# EAGLE design RFID_H2_v7 (EAGLE 9.6.2)
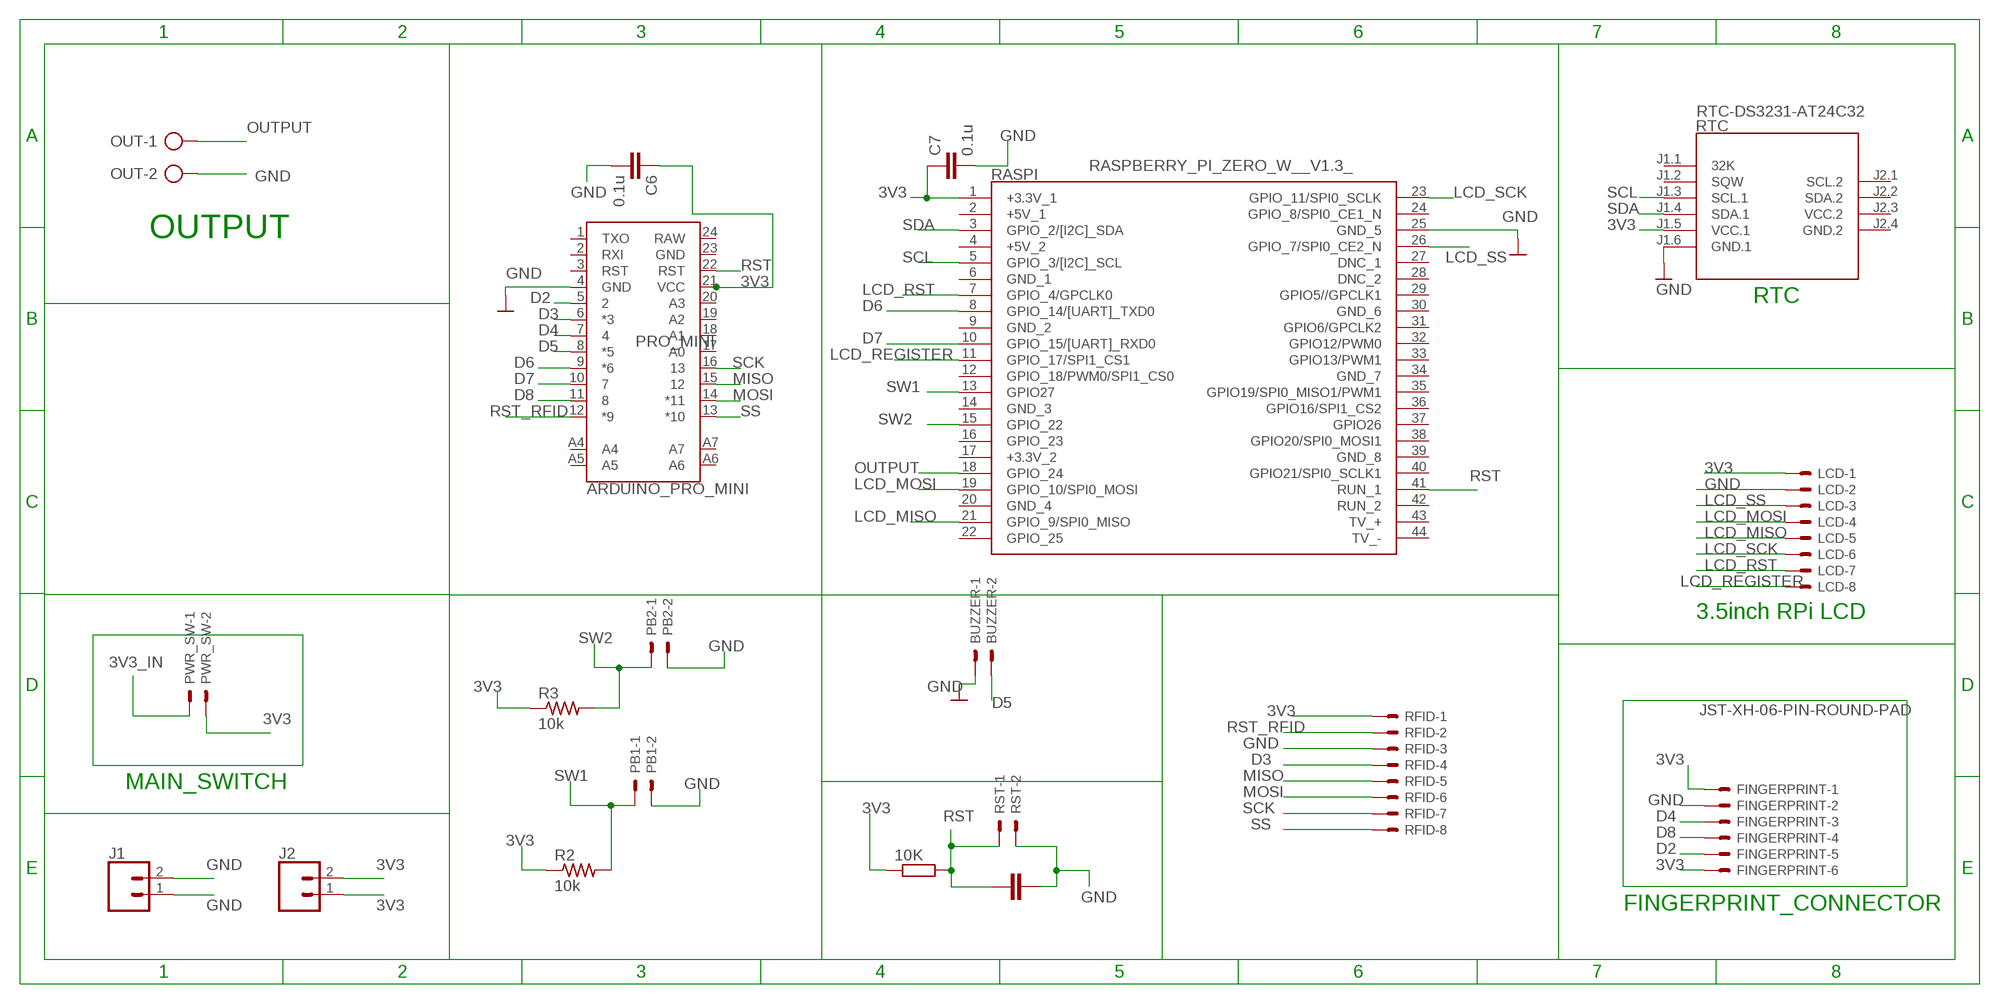
[diagram p0: schematic, sheet 1, part 1 of 2]
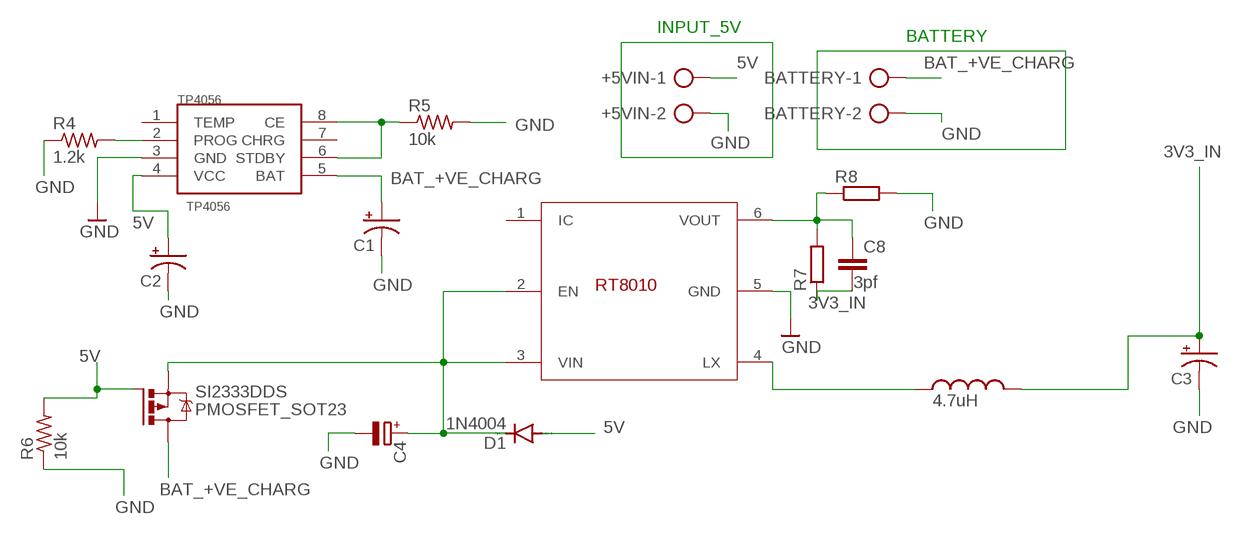
[diagram p1: schematic, sheet 1, part 2 of 2]

## Parts
10K  R-EU_0204/5  [0204/5]
+5VIN  AK500/2-H  [AK500/2-H]
BATTERY  AK500/2-H  [AK500/2-H]
BUZZER  JST-XH-02-PIN-LONG-PAD  [JST-XH-02-PACKAGE-LONG-PAD]
C1  10uf  CAP_POL_10V  [C/6032-28R]
C2  10uf  CAP_POL_10V  [C/6032-28R]
C3  10uf  CAP_POL_10V  [C/6032-28R]
C4  4.7uf  CPOL-EUE2.5-6  [E2,5-6]
C5  10n  C-EUC0805K  [C0805K]
C6  0.1u  C-EUC0805  [C0805]
C7  0.1u  C-EUC0805  [C0805]
C8  3pf  C-EU025-025X050  [C025-025X050]
D1  1N4004  [DO41-10]
FINGERPRINT  JST-XH-06-PIN-ROUND-PAD  [JST-XH-06-PACKAGE-ROUND-PAD]
J1  CONN_02  [1X02]
J2  CONN_02  [1X02]
L2  4.7uH  WE-TI_8095_744772047  [WE-TI_TIHV_8095]
LCD  JST-XH-08-PIN-ROUND-PAD  [JST-XH-08-PACKAGE-ROUND-PAD]
OUT  AK500/2-H  [AK500/2-H]
PB1  JST-XH-02-PIN-LONG-PAD  [JST-XH-02-PACKAGE-LONG-PAD]
PB2  JST-XH-02-PIN-LONG-PAD  [JST-XH-02-PACKAGE-LONG-PAD]
PRO_MINI  ARDUINO_PRO_MINI  [ARDUINO_PRO_MINI]
PWR_SW  JST-XH-02-PIN-LONG-PAD  [JST-XH-02-PACKAGE-LONG-PAD]
R2  10k  R-US_R0805  [R0805]
R3  10k  R-US_R0805  [R0805]
R4  1.2k  R-US_R0805  [R0805]
R5  10k  R-US_R0805  [R0805]
R6  10k  R-US_R0805  [R0805]
R7  1.2M  R-EU_0204/7  [0204/7]
R8  270K  R-EU_0204/7  [0204/7]
RASPI  RASPBERRY_PI_ZERO_W__V1.3_  [RASPBERRYPIZEROWV13]
RFID  JST-XH-08-PIN-ROUND-PAD  [JST-XH-08-PACKAGE-ROUND-PAD]
RST  JST-XH-02-PIN-LONG-PAD  [JST-XH-02-PACKAGE-LONG-PAD]
RT8010  RT8010_BUCK_CONVERTER  [RT8010]
RTC  RTC-DS3231-AT24C32  [RTC-DS3231-AT24C32]
SI2333DDS  PMOSFET_SOT23  [SOT23]
TP4056  TP4056  [SOP-8]

## Nets
3V3: 10K.1 C6.1 C7.1 FINGERPRINT.1 FINGERPRINT.6 J2.1 J2.2 LCD.1 PRO_MINI.21(VCC) PWR_SW.2 R2.1 R3.1 RASPI.1(+3.3V_1) RFID.1 RTC.J1.5(VCC.1)
3V3_IN: C3.+ C8.2 L2.2 PWR_SW.1 R7.1
5V: +5VIN.1 C2.+ D1.A R6.2 SI2333DDS.1(G) TP4056.4(VCC)
BAT_+VE_CHARG: BATTERY.1 C1.+ SI2333DDS.3(D) TP4056.5(BAT)
D2: FINGERPRINT.5 PRO_MINI.5
D3: PRO_MINI.6(*3) RFID.4
D4: FINGERPRINT.3 PRO_MINI.7
D5: BUZZER.2 PRO_MINI.8(*5)
D6: PRO_MINI.9(*6) RASPI.8(GPIO_14/[UART]_TXD0)
D7: PRO_MINI.10 RASPI.10(GPIO_15/[UART]_RXD0)
D8: FINGERPRINT.4 PRO_MINI.11
GND: +5VIN.2 BATTERY.2 BUZZER.1 C1.- C2.- C3.- C4.- C5.1 C6.2 C7.2 FINGERPRINT.2 J1.1 J1.2 LCD.2 OUT.2 PB1.2 PB2.2 PRO_MINI.4(GND) R4.1 R5.2 R6.1 R8.2 RASPI.25(GND_5) RFID.3 RST.2 RT8010.5(GND) RTC.J1.6(GND.1) TP4056.3(GND)
LCD_MISO: LCD.5 RASPI.21(GPIO_9/SPI0_MISO)
LCD_MOSI: LCD.4 RASPI.19(GPIO_10/SPI0_MOSI)
LCD_REGISTER: LCD.8 RASPI.11(GPIO_17/SPI1_CS1)
LCD_RST: LCD.7 RASPI.7(GPIO_4/GPCLK0)
LCD_SCK: LCD.6 RASPI.23(GPIO_11/SPI0_SCLK)
LCD_SS: LCD.3 RASPI.26(GPIO_7/SPI0_CE2_N)
MISO: PRO_MINI.15 RFID.5
MOSI: PRO_MINI.14(*11) RFID.6
N$2: C8.1 R7.2 R8.1 RT8010.6(VOUT)
N$4: R4.2 TP4056.2(PROG)
N$5: R5.1 TP4056.6(STDBY) TP4056.8(CE)
N$6: L2.1 RT8010.4(LX)
N$8: C4.+ D1.C RT8010.2(EN) RT8010.3(VIN) SI2333DDS.2(S)
OUTPUT: OUT.1 RASPI.18(GPIO_24)
RST: 10K.2 C5.2 PRO_MINI.22(RST) RASPI.41(RUN_1) RST.1
RST_RFID: PRO_MINI.12(*9) RFID.2
SCK: PRO_MINI.16 RFID.7
SCL: RASPI.5(GPIO_3/[I2C]_SCL) RTC.J1.3(SCL.1)
SDA: RASPI.3(GPIO_2/[I2C]_SDA) RTC.J1.4(SDA.1)
SS: PRO_MINI.13(*10) RFID.8
SW1: PB1.1 R2.2 RASPI.13(GPIO27)
SW2: PB2.1 R3.2 RASPI.15(GPIO_22)
Unconnected: PRO_MINI.1(TXO) PRO_MINI.2(RXI) PRO_MINI.3(RST) PRO_MINI.17(A0) PRO_MINI.18(A1) PRO_MINI.19(A2) PRO_MINI.20(A3) PRO_MINI.A4 PRO_MINI.A5 PRO_MINI.A6 PRO_MINI.A7 RASPI.2(+5V_1) RASPI.4(+5V_2) RASPI.6(GND_1) RASPI.9(GND_2) RASPI.12(GPIO_18/PWM0/SPI1_CS0) RASPI.14(GND_3) RASPI.16(GPIO_23) RASPI.17(+3.3V_2) RASPI.20(GND_4) RASPI.22(GPIO_25) RASPI.24(GPIO_8/SPI0_CE1_N) RASPI.27(DNC_1) RASPI.28(DNC_2) RASPI.29(GPIO5//GPCLK1) RASPI.30(GND_6) RASPI.31(GPIO6/GPCLK2) RASPI.32(GPIO12/PWM0) RASPI.33(GPIO13/PWM1) RASPI.34(GND_7) RASPI.35(GPIO19/SPI0_MISO1/PWM1) RASPI.36(GPIO16/SPI1_CS2) RASPI.37(GPIO26) RASPI.38(GPIO20/SPI0_MOSI1) RASPI.39(GND_8) RASPI.40(GPIO21/SPI0_SCLK1) RASPI.42(RUN_2) RASPI.43(TV_+) RASPI.44(TV_-) RT8010.1(IC) RTC.J1.1(32K) RTC.J1.2(SQW) RTC.J2.1(SCL.2) RTC.J2.2(SDA.2) TP4056.1(TEMP) TP4056.7(CHRG)

## Notes on the sheet
- INPUT_5V
- BATTERY
- OUTPUT
- RTC
- 3.5inch RPi LCD
- MAIN_SWITCH
- FINGERPRINT_CONNECTOR

## Power pins joined to a net without a drawn wire
GND: PRO_MINI.23(GND)
GND.2: RTC.J2.4(GND.2)
RAW: PRO_MINI.24(RAW)
VCC.2: RTC.J2.3(VCC.2)

## Library data of the parts
10K = resistor:R-EU_: RESISTOR, European symbol
+5VIN BATTERY OUT = con-ptr500:AK500/2-H: CONNECTOR Aug. 2004 / PTR Meßtechnik: Die Bezeichnung der Serie AK505 wurde geändert. Es handelt sich hierbei um AK500 in horizontaler Ausführung.; OC_FARNELL: unknown; OC_NEWARK: unknown
BUZZER PB1 PB2 PWR_SW RST = Rembrandt Electronics - JST XH Connectors v1-0:JST-XH-02-PIN: JST XH Connector 2 Pin Wire to board connector. Pitch: 2,54 mm, (0.100") Number of pins: 2 Created by Rembrandt Electronics www.rembrandtelectronics.com
C1-C3 = CEDT_JANUARY_2015_v5:CAP_POL
C4 = rcl:CPOL-EU: POLARIZED CAPACITOR, European symbol; SPICEPREFIX: C
C5-C8 = rcl:C-EU: CAPACITOR, European symbol; SPICEPREFIX: C
D1 = diode:1N4004: DIODE general purpose rectifier, 1 A
FINGERPRINT = Rembrandt Electronics - JST XH Connectors v1-0:JST-XH-06-PIN: JST XH Connector 2 Pin Wire to board connector. Pitch: 2,54 mm, (0.100") Number of pins: 6 Created by Rembrandt Electronics www.rembrandtelectronics.com
J1 J2 = SparkFun-Connectors:CONN_02: Multi connection point. Often used as Generic Header-pin footprint for 0.1 inch spaced/style header connections On any of the 0.1 inch spaced packages, you can populate with these: Break Away Headers - Straight <https://www.sparkfun.com/products/116> (PRT-00116) Break Away Male Headers - Right Angle <https://www.sparkfun.com/products/553> (PRT-00553) Female Headers <https://www.sparkfun.com/products/115> (PRT-00115) Break Away Headers - Machine Pin <https://www.sparkfun.com/products/117> (PRT-00117) Break Away Female Headers - Swiss Machine Pin <https://www.sparkfun.com/products/743> (PRT-00743) For SCREWTERMINALS and SPRING TERMINALS visit here: Screw Terimnals on SparkFun.com <https://www.sparkfun.com/search/results?term=Screw+Terminals> (5mm/3.5mm/2.54mm spacing) This device is also useful as a general connection point to wire up your design to another part of your project. Our various solder wires solder well into these plated through hole pads. Hook-Up Wire - Assortment (Stranded, 22 AWG) <https://www.sparkfun.com/products/11375> (PRT-11375) Hook-Up Wire - Assortment (Solid Core, 22 AWG) <https://www.sparkfun.com/products/11367> (PRT-11367) View the entire wire category on our website here <https://www.sparkfun.com/categories/141> Special notes: Molex polarized connector foot print use with: PRT-08233 with associated crimp pins and housings. 2.54_SCREWTERM for use with PRT-10571. 3.5mm Screw Terminal footprints for PRT-08084 5mm Screw Terminal footprints for use with PRT-08432
L2 = Wurth_Elektronik_Passive_rev19e:WE-TI_8095: Radial Leaded Wire Wound Inductor Characteristics Radial through-hole inductor High saturation core material Small size Maximum current up to 8.5 A Custom design on request Applications Signal filtering Switches, switching power supply for small and medium voltage Power supply filter EMI filter <http://katalog.we-online.de/media/images/v2/we-ti_tonneninduktivitaet.jpg> Details see: http://katalog.we-online.de/en/pbs/WE-TI? Updated by Dan Xu 2014-07-11 2014 (C) Wurth Elektronik; WE-NUMBER: 744772047/4,7uH
LCD RFID = Rembrandt Electronics - JST XH Connectors v1-0:JST-XH-08-PIN: JST XH Connector 2 Pin Wire to board connector. Pitch: 2,54 mm, (0.100") Number of pins: 8 Created by Rembrandt Electronics www.rembrandtelectronics.com
PRO_MINI = SparkFun-Boards:ARDUINO_PRO_MINI: SparkFun Pro Mini Pro Mini compatible footprint. Dimensions: 0.7 x 1.3" PCB Thickness: 0.8mm SparkFun Products: 3.3V/8MHz <https://www.sparkfun.com/products/11114> 5V/16MHz <https://www.sparkfun.com/products/11113>
R2 R3 = audio amplifier example:R-US_: RESISTOR, American symbol
R4-R6 = adafruit:R-US_: RESISTOR, American symbol
R7 R8 = rcl:R-EU_: RESISTOR, European symbol; SPICEPREFIX: R
RASPI = Raspberry_Pi_Zero_W__v1.3_:RASPBERRY_PI_ZERO_W__V1.3_: Raspberry Pi Zero W (v1.3) Single-board Computers Source: Datasheet <https://cdn.sparkfun.com/assets/learn_tutorials/6/7/6/PiZero_1.pdf>; DESCRIPTION: Raspberry Pi Zero W (v1.3) Single-board Computers; HEIGHT: mm; MANUFACTURER_NAME: RASPBERRY-PI; MANUFACTURER_PART_NUMBER: Raspberry Pi Zero W (v1.3)
RT8010 = RT8010_buckConverter:RT8010_BUCK_CONVERTER
RTC = diy-modules:RTC-DS3231-AT24C32: RTC Module with Battery and EEPROM based on DS3231 and AT24C32 chips Tutorial can be found here: https://edwardmallon.wordpress.com/2014/05/21/using-a-cheap-3-ds3231-rtc-at24c32-eeprom-from-ebay/ Click here to find device on ebay.com <http://www.ebay.com/sch/DS3231+AT24C32+module>
SI2333DDS = Transistor:PMOSFET: P-Channel MOSFET - Generic; CATEGORY: Transistor; SUB-CATEGORY: MOSFET; TYPE: P-Channel
TP4056 = TP4056:TP4056

## Board
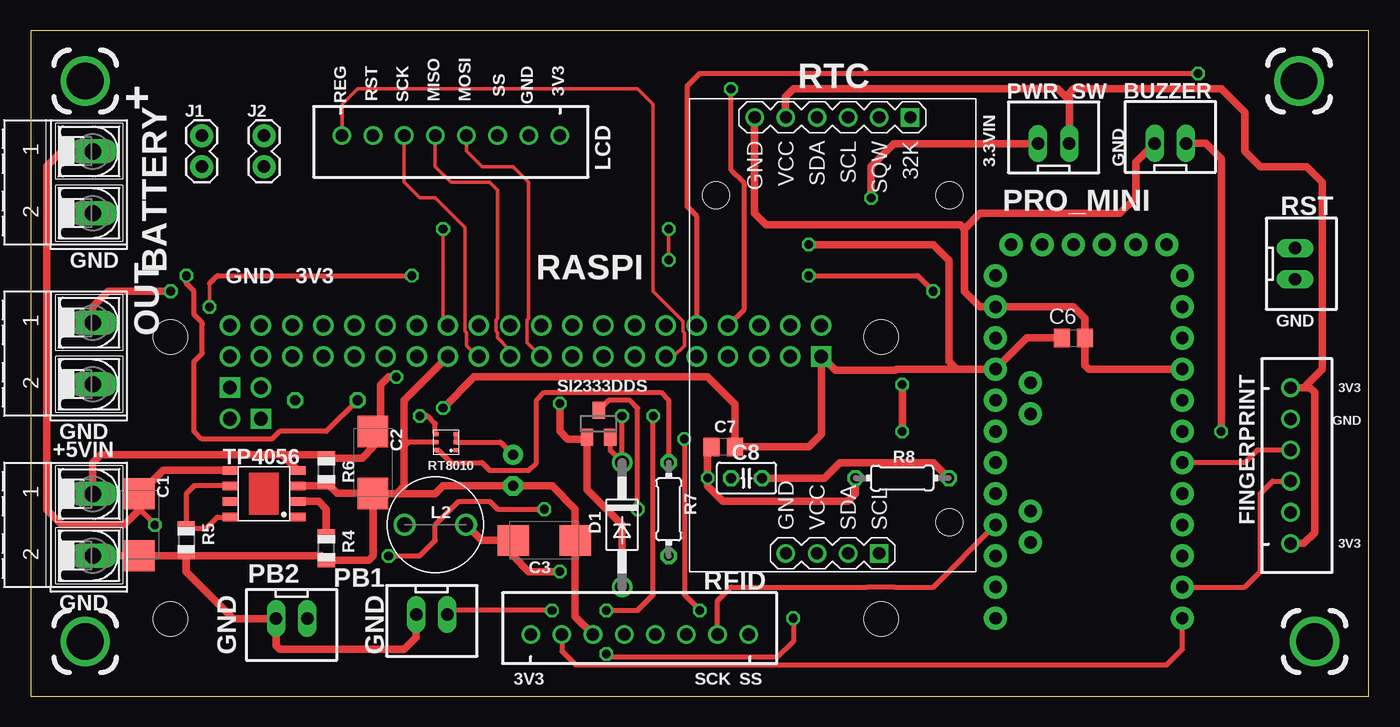
[diagram p2: board, top side]
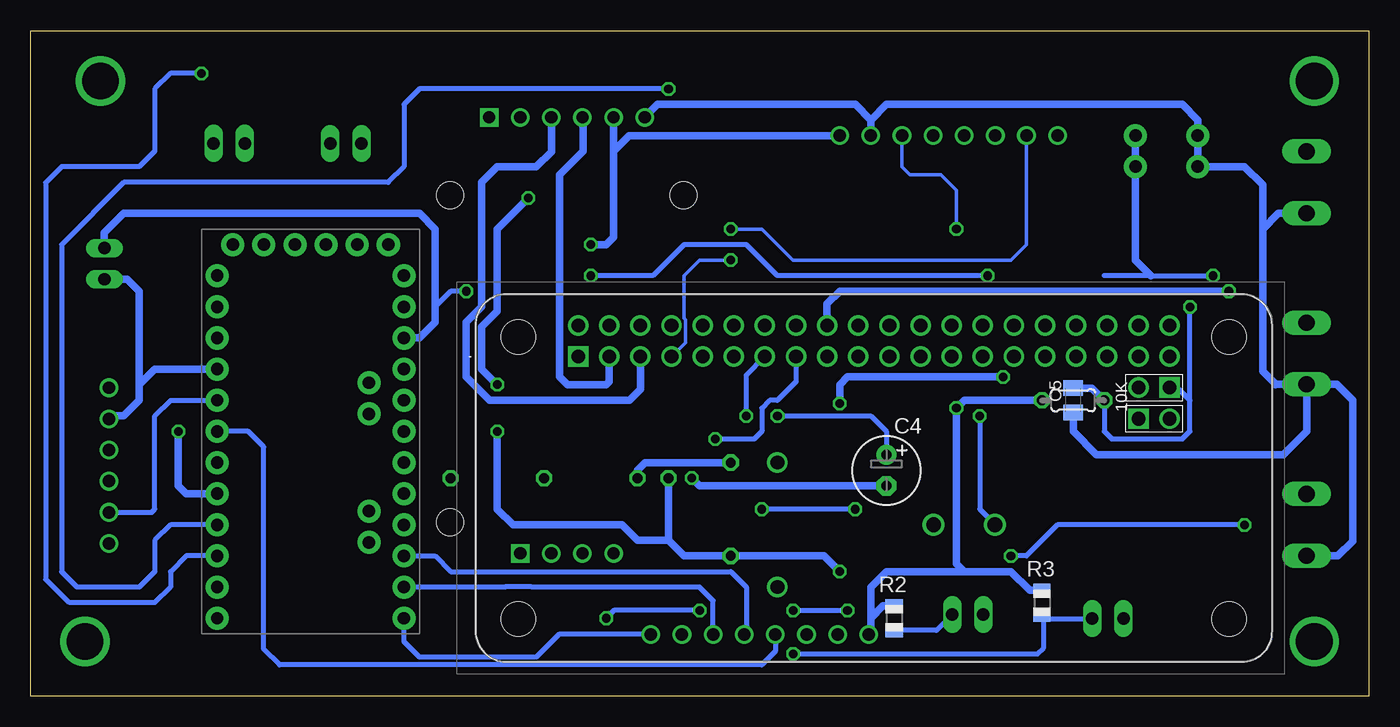
[diagram p3: board, bottom side, seen from below]

Size 109.2 x 54.28 mm. Coordinates in mm from the lower left corner, seen from the top.
Outline: 0,0 109.2,0 109.2,54.28 0,54.28 0,0
Copper layers (1*16): Top 0.035mm / dielectric 1.5mm / Bottom 0.035mm
Design rules "default": minimum track width 6mil, minimum drill 0.35mm, track to track 6mil, track to pad 6mil, pad to pad 6mil, via to via 6mil, smd to smd 6mil, copper to edge 40mil, drill to drill 6mil, minimum pad ring 10mil, minimum via ring 8mil, stop-mask expansion 4mil, vias tented up to drill 0mil, thermal gap 10mil

### Footprints (pad centres in the part's own frame; a part is rotated, then mirrored left to right if it is on the bottom)
0204/5 = drill 0.813 octagon: 1 -2.54,0; 2 2.54,0
AK500/2-H = drill 1.321 long: 1 -2.515,0; 2 2.515,0
JST-XH-02-PACKAGE-LONG-PAD = drill 1.016 long: 1 -1.27,0; 2 1.27,0
C/6032-28R = smd 2.55 x 2.5: + 2.525,0; - -2.525,0
E2,5-6 = drill 0.813 pad 1.6: + -1.27,0 | drill 0.813 pad 1.6 octagon: - 1.27,0
C0805K = smd 1.3 x 1.6: 1 -1,0; 2 1,0
C0805 = smd 1.3 x 1.5: 1 -0.95,0; 2 0.95,0
C025-025X050 = drill 0.813 octagon: 1 -1.27,0; 2 1.27,0
DO41-10 = drill 1.118: A 5.08,0; C -5.08,0
JST-XH-06-PACKAGE-ROUND-PAD = drill 1.016: 1 -6.35,0; 2 -3.81,0; 3 -1.27,0; 4 1.27,0; 5 3.81,0; 6 6.35,0
1X02 = drill 1.016 pad 1.88: 1 0,0; 2 2.54,0
WE-TI_TIHV_8095 = drill 1.2: 1 -2.5,0; 2 2.5,0
JST-XH-08-PACKAGE-ROUND-PAD = drill 1.016: 1 -8.89,0; 2 -6.35,0; 3 -3.81,0; 4 -1.27,0; 5 1.27,0; 6 3.81,0; 7 6.35,0; 8 8.89,0
ARDUINO_PRO_MINI = drill 1.016 pad 1.88: 1 -7.62,12.7; 2 -7.62,10.16; 3 -7.62,7.62; 4 -7.62,5.08; 5 -7.62,2.54; 6 -7.62,0; 7 -7.62,-2.54; 8 -7.62,-5.08; 9 -7.62,-7.62; 10 -7.62,-10.16; 11 -7.62,-12.7; 12 -7.62,-15.24; 13 7.62,-15.24; 14 7.62,-12.7; 15 7.62,-10.16; 16 7.62,-7.62; 17 7.62,-5.08; 18 7.62,-2.54; 19 7.62,0; 20 7.62,2.54; 21 7.62,5.08; 22 7.62,7.62; 23 7.62,10.16; 24 7.62,12.7; A4 4.763,1.429; A5 4.763,3.969; A6 4.763,-9.049; A7 4.763,-6.509; BLK -6.35,15.24; GND -3.81,15.24; GRN 6.35,15.24; RXI 1.27,15.24; TXO 3.81,15.24; VCC -1.27,15.24
R0805 = smd 1.1 x 1.4: 1 -1,0; 2 1,0
0204/7 = drill 0.813 octagon: 1 -3.81,0; 2 3.81,0
RASPBERRYPIZEROWV13 = drill 1.11 pad 1.665 square: 1 -23.885,9.92; 41 24.375,7.38; 43 21.835,4.84 | drill 1.11 pad 1.665: 2 -23.885,12.46; 3 -21.345,9.92; 4 -21.345,12.46; 5 -18.805,9.92; 6 -18.805,12.46; 7 -16.265,9.92; 8 -16.265,12.46; 9 -13.725,9.92; 10 -13.725,12.46; 11 -11.185,9.92; 12 -11.185,12.46; 13 -8.645,9.92; 14 -8.645,12.46; 15 -6.105,9.92; 16 -6.105,12.46; 17 -3.565,9.92; 18 -3.565,12.46; 19 -1.025,9.92; 20 -1.025,12.46; 21 1.515,9.92; 22 1.515,12.46; 23 4.055,9.92; 24 4.055,12.46; 25 6.595,9.92; 26 6.595,12.46; 27 9.135,9.92; 28 9.135,12.46; 29 11.675,9.92; 30 11.675,12.46; 31 14.215,9.92; 32 14.215,12.46; 33 16.755,9.92; 34 16.755,12.46; 35 19.295,9.92; 36 19.295,12.46; 37 21.835,9.92; 38 21.835,12.46; 39 24.375,9.92; 40 24.375,12.46; 42 21.835,7.38; 44 24.375,4.84 | hole 2.8: -28.755,11.5; -28.755,-11.5; 29.245,-11.5; 29.245,11.5
RT8010 = smd 0.35 x 0.4: 1 0.375,0.2; 2 1.025,0.2; 3 1.675,0.2; 4 1.675,1.85; 5 1.025,1.85; 6 0.375,1.85
RTC-DS3231-AT24C32 = drill 1 square: J1.1 -17.78,6.35; J2.1 17.78,3.81 | drill 1: J1.2 -17.78,3.81; J1.3 -17.78,1.27; J1.4 -17.78,-1.27; J1.5 -17.78,-3.81; J1.6 -17.78,-6.35; J2.2 17.78,1.27; J2.3 17.78,-1.27; J2.4 17.78,-3.81 | hole 2.2: -11.43,-9.525; -11.43,9.525; 15.24,9.525
SOT23 = smd 1 x 1.4: 1 -0.95,-1.1; 2 0.95,-1.1; 3 0,1.1
SOP-8 = smd 1.3 x 0.7: 1 -2.75,1.905; 2 -2.75,0.635; 3 -2.75,-0.635; 4 -2.75,-1.905; 5 2.75,-1.905; 6 2.75,-0.635; 7 2.75,0.635; 8 2.75,1.905

### Placement (x,y rotation side)
10K  24.13,24.13 0 bottom
+5VIN  5.08,13.97 270 top
BATTERY  5.08,41.91 270 top
BUZZER  93,45.09 0 top
C1  8.89,13.97 90 top
C2  27.94,19.05 90 top
C3  41.91,12.7 180 top
C4  39.37,18.41 270 bottom
C5  24.13,24.13 90 bottom
C6  85.09,29.21 0 top
C7  56.52,20.32 180 top
C8  58.42,17.78 180 top
D1  48.26,13.97 270 top
FINGERPRINT  102.82,18.8 270 top
J1  13.97,43.18 90 top
J2  19.05,43.18 90 top
L2  33.02,13.97 0 top
LCD  34.29,45.72 180 top
OUT  5.08,27.94 270 top
PB1  32.73,6.65 180 top
PB2  21.3,6.32 180 top
PRO_MINI  86.36,21.59 0 bottom
PWR_SW  83.47,45.06 0 top
R2  38.73,6.35 270 bottom
R3  26.67,7.62 270 bottom
R4  24.13,12.06 90 top
R5  12.7,12.7 270 top
R6  24.13,18.41 90 top
R7  52.07,15.24 90 top
R8  71.12,17.78 180 top
RASPI  40.64,17.78 0 bottom
RFID  49.7,5.03 0 top
RST  103.18,35.27 270 top
RT8010  34.92,19.68 90 top
RTC  65.44,29.43 270 top
SI2333DDS  46.35,22.23 0 top
TP4056  19.05,16.51 180 top

### Tracks (layer width: path | path; a pad name or v marks a point on that pad's centre or on a via)
3V3  (via drill 0.7 pad 0.95)
  Top 0.406: 10K.1 24.13,21.59 20.32,21.59 19.68,20.95 13.97,20.95 13.34,21.59 13.34,27.3 14.01,27.98 14.01,30.36 13.97,30.41 13.97,30.48 13.34,31.11 13.34,33.02 12.7,33.66 v12.7,34.29
  Top 0.61: FINGERPRINT.1 104.14,25.15 | 104.14,25.15 104.39,25.15 104.78,24.77 104.78,13.34 103.89,12.45 FINGERPRINT.6 | C6.1 81.28,29.21 PRO_MINI.21 75.56,26.67 | 75.56,26.67 70.63,26.67 70.52,26.56 65.67,26.56 RASPI.1 64.53,21.34 63.5,20.32 C7.1 57.47,23.82 55.24,26.04 36.2,26.04 v33.66,23.5 | 75.56,26.67 74.93,27.3 74.93,35.56 73.66,36.83 v63.5,36.83 | RTC.J1.5 61.59,47.24 61.59,48.9 62.23,49.53 83.82,49.53 84.75,48.6 PWR_SW.2 84.75,49.19 85.09,49.53 97.16,49.53 99.06,47.62 99.06,44.45 100.33,43.18 104.14,43.18 105.41,41.91 105.41,26.67 104.14,25.4 104.14,25.15
  Bottom 0.406: v12.7,34.29 17.78,34.29 21.59,34.29
  Bottom 0.61: R2.1 39.64,7.35 40.64,6.35 | 40.64,6.35 40.64,5.2 RFID.1 | R3.1 27.67,8.62 29.21,10.16 33.02,10.16 | 33.02,10.16 39.37,10.16 40.64,8.89 40.64,6.35 | J2.2 J2.1 19.05,35.56 17.78,34.29 | 61.63,44.45 61.63,37.43 62.23,36.83 v63.5,36.83 | 61.63,44.45 RTC.J1.5 | FINGERPRINT.1 103.07,25.4 | 10K.1 33.02,24.13 v33.66,23.5 33.66,10.79 33.02,10.16 | LCD.1 60.36,45.72 61.63,44.45
3V3_IN  (via drill 0.7 pad 0.95)
  Top 0.61: L2.2 36.79,12.7 C3.+ 39.37,12.69 39.37,11.43 40.64,10.16 v43.18,10.16 | v68.58,40.64 68.58,43.18 70.47,45.06 PWR_SW.1 | v71.12,25.4 v71.12,21.59
  Bottom 0.61: v43.18,10.16 44.45,11.43 R7.1 55.88,11.43 57.15,12.7 | 57.15,12.7 C8.2 | 57.15,12.7 59.69,12.7 60.96,13.97 69.85,13.97 71.12,15.24 v71.12,21.59 | v68.58,40.64 71.12,38.1 71.12,31.4 72.39,30.13 72.39,26.67 v71.12,25.4
5V  (via drill 0.7 pad 0.95)
  Top 0.61: +5VIN.1 5.08,19.05 5.71,19.68 20.32,19.68 20.53,19.68 | D1.A 48.26,13.97 45.41,16.82 SI2333DDS.1 45.23,20.95 43.81,20.95 43.18,21.59 v43.18,23.86 | v29.84,26.04 29.21,26.04 28.57,25.4 28.57,22.21 C2.+ 27.94,20.32 27.04,19.41 R6.2 23.77,19.41 23.5,19.68 20.53,19.68 | TP4056.4 20.53,19.68
  Bottom 0.61: v29.84,26.04 42.55,26.04 43.18,25.4 v43.18,23.86
BAT_+VE_CHARG  (via drill 0.7 pad 0.95)
  Top 0.406: 8.89,15.24 v10.16,13.97 | v29.21,11.43 31.75,11.43 33.02,12.7 33.02,13.97 34.92,15.88 37.47,15.88 38.1,15.24 v41.91,15.24 | SI2333DDS.3 47.16,24.13 48.9,24.13 49.53,23.5 v49.53,15.24
  Top 0.61: TP4056.5 10.81,18.41 C1.+ 8.89,15.24 7.62,13.97 2.54,13.97 1.32,15.19 1.32,43.23 2.54,44.45 5.05,44.45 BATTERY.1
  Bottom 0.406: v10.16,13.97 25.4,13.97 27.94,11.43 v29.21,11.43 | v41.91,15.24 v49.53,15.24
D2
  Bottom 0.406: 102.44,14.61 FINGERPRINT.5 99.31,14.99 99.06,15.24 99.06,22.86 97.79,24.13 PRO_MINI.5
D3
  Bottom 0.406: RFID.4 48.43,3.64 49.53,2.54 88.9,2.54 90.17,3.81 90.17,20.32 91.44,21.59 PRO_MINI.6
D4
  Top 0.406: FINGERPRINT.3 100.08,20.07 99.06,19.05 PRO_MINI.7
D5  (via drill 0.7 pad 0.95)
  Top 0.61: BUZZER.2 95.55,45.09 95.89,45.09 97.16,43.81 v97.16,21.59
  Bottom 0.61: v97.16,21.59 97.16,17.14 96.52,16.51 PRO_MINI.8
D6  (via drill 0.7 pad 0.95)
  Top 0.406: v57.15,49.53 57.15,42.91 58.23,41.82 58.23,31.57 RASPI.8
  Bottom 0.406: PRO_MINI.9 97.79,13.97 99.06,12.7 99.06,10.16 100.33,8.89 105.41,8.89 106.68,10.16 106.68,36.83 101.6,41.91 80.01,41.91 78.74,43.18 78.74,48.26 77.47,49.53 v57.15,49.53
D7  (via drill 0.7 pad 0.95)
  Top 0.406: RASPI.10 54.37,39.13 53.6,39.9 53.6,49.79 54.61,50.8 v95.25,50.8
  Bottom 0.406: PRO_MINI.10 96.52,11.43 97.79,10.16 97.79,8.89 99.06,7.62 106.05,7.62 107.95,9.53 107.98,9.53 107.98,41.88 106.68,43.18 100.33,43.18 99.06,44.45 99.06,49.53 97.79,50.8 v95.25,50.8
D8
  Top 0.406: PRO_MINI.11 99.06,8.89 100.33,10.16 100.33,16.51 101.35,17.53 FINGERPRINT.4
GND  (via drill 0.7 pad 0.95)
  Top 0.305: C1.- 8.87,11.46
  Top 0.406: 30.48,20.32 30.87,20.71 RT8010.5
  Top 0.61: +5VIN.2 8.87,11.46 8.89,11.43 | 12.45,11.45 C1.- | 12.45,11.45 R5.2 | 12.45,11.45 12.7,11.19 12.7,10.16 16.54,6.32 PB2.2 20.03,4.1 20.32,3.81 30.48,3.81 31.46,4.79 PB1.2 | 12.45,11.45 23.75,11.45 R4.1 27.57,11.06 27.94,11.43 C2.- | C2.- 25.02,16.52 R6.1 23.86,17.14 TP4056.3 | 29.84,16.51 33.02,16.51 33.66,17.14 C4.- 42.55,17.14 44.44,15.26 C3.- 44.44,6.49 RFID.3 | 29.84,16.51 27.95,16.51 C2.- | PRO_MINI.4 86.36,26.67 86.04,26.99 C6.2 86.04,30.8 85.09,31.75 PRO_MINI.23 77.47,31.75 76.2,33.02 76.2,38.1 | 76.2,38.1 77.47,39.37 88.9,39.37 90.17,40.64 90.17,43.53 BUZZER.1 | 76.2,38.1 75.86,38.44 59.99,38.44 59.05,39.37 59.05,47.17 RTC.J1.6 | RASPI.25 30.48,24.14 30.48,20.32 30.48,17.14 29.84,16.51 | C7.2 55.24,20 v55.24,17.78 55.24,17.14 56.52,15.88 66.67,15.88 67.31,16.51 R8.2
  Bottom 0.61: C5.1 24.13,21.59 22.23,19.68 6.99,19.68 5.08,21.59 OUT.2 | J1.1 J1.2 13.97,46.99 15.24,48.26 39.37,48.26 40.64,46.99 | FINGERPRINT.2 102.57,22.86 101.6,22.86 100.33,24.13 100.33,25.4 | 100.33,25.4 99.06,26.67 PRO_MINI.4 | RST.2 101.31,34 100.33,33.02 100.33,25.4 | C4.- 54.61,17.14 v55.24,17.78 | 3.81,11.46 +5VIN.2 | 3.81,11.46 3.79,11.46 | 3.81,11.46 3.79,11.43 2.54,11.43 1.32,12.65 1.32,24.13 2.62,25.43 OUT.2 | 13.97,44.45 J1.1 | 7.59,25.43 OUT.2 | 7.59,25.43 7.62,25.4 | 7.59,25.43 8.67,26.5 8.67,38.1 | BATTERY.2 7.38,39.4 8.67,38.1 | J1.1 10.16,43.18 8.67,41.69 8.67,38.1 | 40.64,46.99 LCD.2 40.64,46.99 | 40.64,46.99 41.91,48.26 58.04,48.26 RTC.J1.6
LCD_MISO
  Top 0.305: RASPI.21 39.12,28.18 38.1,29.21 38.1,29.66 37.99,29.77 37.99,30.71 38.1,30.82 38.1,41.27 | LCD.5 33.02,43.18 34.29,41.91 37.47,41.91 37.78,41.59 | 37.78,41.59 38.1,41.27 | 38.1,41.27 37.78,41.59
LCD_MOSI
  Top 0.305: RASPI.19 40.53,28.84 40.53,30.71 40.64,30.82 40.64,41.91 | LCD.4 35.56,44.45 36.83,43.18 39.37,43.18 40.64,41.91 | 40.64,41.91 40.64,40.64
LCD_REGISTER
  Top 0.305: RASPI.11 52.47,27.7 53.34,28.57 53.34,29.66 53.23,29.77 53.23,30.59 50.8,33.02 50.8,48.26 49.53,49.53 26.67,49.53 25.4,48.26 LCD.8
LCD_RST  (via drill 0.7 pad 0.95)
  Top 0.305: v52.07,35.56 v52.07,38.1
  Bottom 0.305: v52.07,35.56 54.61,35.56 55.88,34.29 55.88,30.82 55.77,30.71 55.77,28.84 RASPI.7 | LCD.7 27.94,36.83 29.21,35.56 46.99,35.56 49.53,38.1 v52.07,38.1
LCD_SCK
  Top 0.305: RASPI.23 36.44,27.7 35.56,28.57 35.56,29.66 35.45,29.77 35.45,38.21 33.02,40.64 31.75,40.64 30.48,41.91 LCD.6
LCD_SS  (via drill 0.7 pad 0.95)
  Top 0.305: RASPI.26 33.66,30.63 v33.66,38.1
  Bottom 0.305: v33.66,38.1 33.66,41.27 34.92,42.55 37.47,42.55 38.1,43.18 LCD.3
MISO
  Bottom 0.406: PRO_MINI.15 76.2,11.43 74.93,10.16 52.07,10.16 50.8,8.89 50.8,5.08 50.92,5.08 RFID.5
MOSI
  Bottom 0.406: RFID.6 53.51,7.79 54.61,8.89 68.3,8.89 68.31,8.9 70.48,8.9 70.49,8.89 PRO_MINI.14
N$2
  Top 0.406: RT8010.6 33.28,20.06 34.29,19.05 36.83,19.05 37.47,18.41 40.64,18.41 41.27,19.05 41.27,24.13 41.91,24.77 51.44,24.77 52.07,24.13 R7.2
  Top 0.61: C8.1 64.77,17.78 66.04,19.05 73.66,19.05 R8.1
  Bottom 0.61: R7.2 59.05,19.05 59.69,18.41 C8.1
N$4
  Top 0.61: TP4056.2 23.5,15.88 24.13,15.24 R4.2
N$5
  Top 0.406: TP4056.8 15.24,14.61 14.34,13.7 R5.1 12.7,16.51 13.34,17.14 TP4056.6
N$6  (via drill 0.7 pad 0.95)
  Top 0.406: RT8010.4 33.02,21.41 33.02,22.23 32.38,22.86 v31.75,22.86
  Bottom 0.406: v31.75,22.86 31.75,15.24 30.52,14.01 L2.1
N$8  (via drill 0.7 pad 0.95)
  Top 0.406: D1.C 47.3,20 SI2333DDS.2 | RT8010.3 RT8010.2 38.34,20.71 C4.+ | D1.C 48.26,17.78 | D1.C v48.26,22.86
  Bottom 0.406: v48.26,22.86 40.64,22.86 39.37,21.59 C4.+
N$10  (via drill 3)
  other vias: 104.78,4.45
N$12  (via drill 3)
  other vias: 103.5,50.16
N$13  (via drill 3)
  other vias: 4.45,4.45
N$14  (via drill 3)
  other vias: 4.45,50.16
OUTPUT  (via drill 0.7 pad 0.95)
  Top 0.61: OUT.1 5.08,31.75 6.35,33.02 v11.43,33.02
  Bottom 0.61: RASPI.18 44.2,32 43.18,33.02 v11.43,33.02
RST  (via drill 0.7 pad 0.95)
  Top 0.305: v14.61,31.75 14.61,33.66
  Top 0.406: v73.66,33.02 72.39,34.29 v63.5,34.29 | 14.61,33.66 15.24,34.29 v31.11,34.29
  Bottom 0.406: 10K.2 21.59,21.59 20.98,20.98 15.21,20.98 14.61,21.59 14.61,24.13 | RASPI.41 15.63,25.16 14.61,24.13 | 14.61,24.13 v14.61,31.75 | v73.66,33.02 74.93,33.02 76.2,31.75 | v31.11,34.29 48.26,34.29 50.8,36.83 55.88,36.83 58.42,34.29 v63.5,34.29
  Bottom 0.61: 10K.2 22.59,25.13 C5.2 | PRO_MINI.22 77.47,29.21 76.2,30.48 76.2,31.75 76.2,38.1 77.47,39.37 101.6,39.37 103.18,37.79 RST.1
RST_RFID
  Top 0.406: RFID.2 43.35,3.64 44.45,2.54 92.71,2.54 93.98,3.81 PRO_MINI.12
SCK
  Top 0.406: RFID.7 56.05,7.79 57.15,8.89 68.3,8.89 68.31,8.9 70.48,8.9 70.49,8.89 73.66,8.89 PRO_MINI.16
SCL
  Bottom 0.61: RTC.J1.3 66.71,44.41 67.94,43.18 71.12,43.18 72.39,41.91 72.39,31.75 73.66,30.48 73.66,26.04 72.39,24.77 72.07,24.45 71.75,24.13 60.33,24.13 59.45,25.01 RASPI.5
SDA
  Bottom 0.61: RASPI.3 61.98,25.64 62.23,25.4 65.41,25.4 66.04,26.04 66.04,42.55 64.14,44.45 64.14,47.17 RTC.J1.4
SS
  Bottom 0.406: RFID.8 66.09,5.03 67.94,3.17 77.47,3.17 78.74,4.45 PRO_MINI.13
SW1  (via drill 0.7 pad 0.95)
  Top 0.406: v46.99,6.99 49.53,6.99 50.8,8.26 v50.8,22.86 | v42.55,6.99 34.34,6.99 PB1.1
  Bottom 0.406: R2.2 35.3,5.35 PB1.1 | v46.99,6.99 v42.55,6.99 | v50.8,22.86 50.8,26.18 RASPI.13
SW2  (via drill 0.7 pad 0.95)
  Top 0.406: v53.34,20.95 53.34,8.26 v54.61,6.99 | v62.23,6.35 62.23,4.45 60.96,3.17 46.99,3.17 v46.99,3.45
  Bottom 0.406: 26.54,6.49 26.37,6.32 PB2.1 22.86,6.61 | 26.54,6.49 R3.2 | RASPI.15 46.74,25.64 48.26,24.13 48.9,24.13 49.53,23.5 49.53,21.59 50.16,20.95 v53.34,20.95 | v54.61,6.99 61.59,6.99 v62.23,6.35 | v46.99,3.45 27.03,3.45 26.54,3.94 26.54,6.49

### Text on the board
tNames: MISO | MOSI | REG | RST | SCK | GND | 3V3 | SS | + | GND | 3.3VIN | GND | GND | 3V3 | GND | 3V3 | GND | GND | RT8010 | 3V3 | GND | GND | GND | 3V3 | SCK | SS